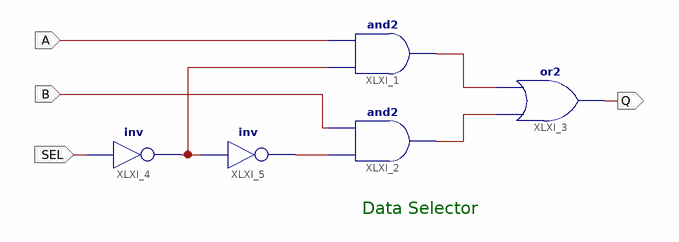
[diagram p0: schematic sheet 1]
// Xilinx ISE schematic data_selector.sch (spartan3a) as structural Verilog: 5 symbols, 4 ports
module data_selector (
  input  A,
  input  SEL,
  input  B,
  output Q
);

  wire XLXN_2, XLXN_3, XLXN_4, XLXN_7;

  not XLXI_4 (XLXN_7, SEL);
  not XLXI_5 (XLXN_2, XLXN_7);
  and XLXI_1 (XLXN_4, XLXN_7, A);
  and XLXI_2 (XLXN_3, XLXN_2, B);
  or XLXI_3 (Q, XLXN_3, XLXN_4);

  // Notes on the sheet:
  //   Data Selector
endmodule
